# Altium project 2AM.PrjPcb
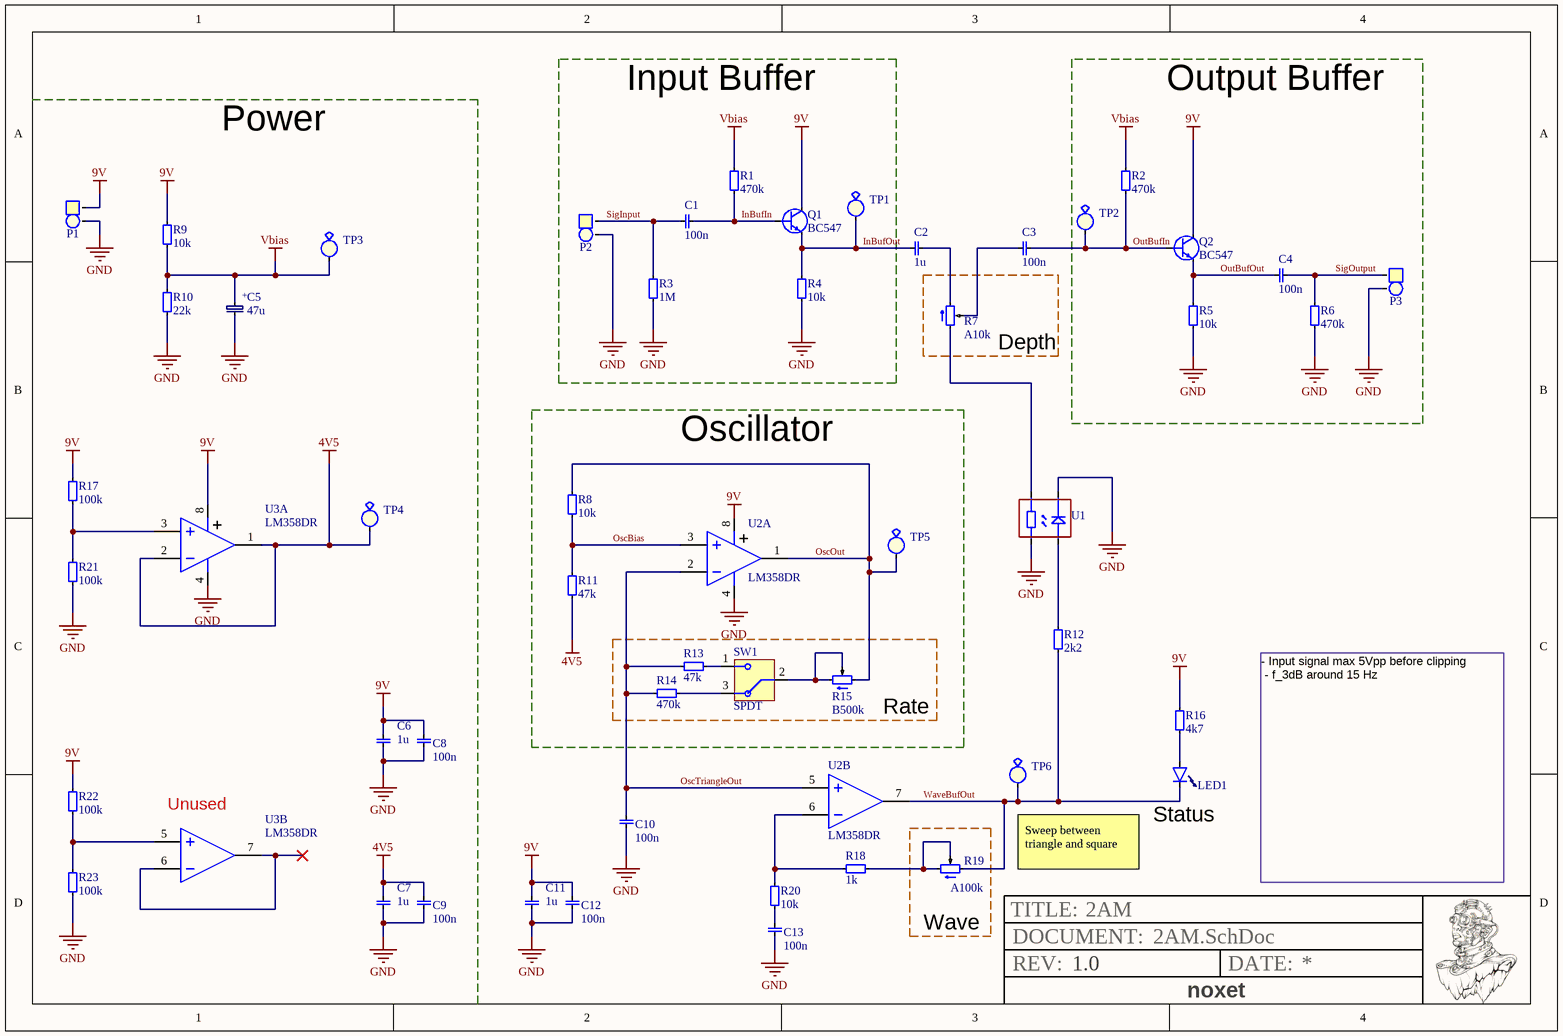
[diagram p0: 2AM.SchDoc]
Revision: 1.0; Title: 2AM
1 sheet, 52 parts. Net scope: global (net labels, ports and power ports of the same name join across sheets).
Board file: 2AM.PcbDoc

## Sheet 2AM.SchDoc: 2AM
size A4; SheetNumber: 1; SheetTotal: 1

### Parts
C1  value 100n  [0805, cap]  (hidden comment: TH, cap)
C2  value 1u  [0805, cap]  (hidden comment: TH, cap)
C3  value 100n  [0805, cap]  (hidden comment: TH, cap)
C4  value 100n  [0805, cap]  (hidden comment: TH, cap)
C5  value 47u  [Cap, SMD, Polar, 5.3x5.3mm]  (hidden comment: Capacitor, TH 2mm)
C6  value 1u  [0805, cap]  (hidden comment: TH, cap)
C7  value 1u  [0805, cap]  (hidden comment: TH, cap)
C8  value 100n  [0805, cap]  (hidden comment: TH, cap)
C9  value 100n  [0805, cap]  (hidden comment: TH, cap)
C10  value 100n  [0805, cap]  (hidden comment: TH, cap)
C11  value 1u  [0805, cap]  (hidden comment: TH, cap)
C12  value 100n  [0805, cap]  (hidden comment: TH, cap)
C13  value 100n  [0805, cap]  (hidden comment: TH, cap)
LED1  0805, LED  [LED_Radial_5mm_Standoff_10mm]  (value not drawn)
P1  1x2 Pin Header  [padtwo_L]  (value not drawn)
P2  1x2 Pin Header  [padtwo_L]  (value not drawn)
P3  1x2 Pin Header  [padtwo_L]  (value not drawn)
Q1  BC547  [BC547_TO-92_BENT]
Q2  BC547  [BC547_TO-92_BENT]
R1  value 470k  [0805]  (hidden comment: TH, resistor)
R2  value 470k  [0805]  (hidden comment: TH, resistor)
R3  value 1M  [0805]  (hidden comment: TH, resistor)
R4  value 10k  [0805]  (hidden comment: TH, resistor)
R5  value 10k  [0805]  (hidden comment: TH, resistor)
R6  value 470k  [0805]  (hidden comment: TH, resistor)
R7  value A10k  [RK09_15mm]  (hidden comment: Potentiometer)
R8  value 10k  [0805]  (hidden comment: TH, resistor)
R9  value 10k  [0805]  (hidden comment: TH, resistor)
R10  value 22k  [0805]  (hidden comment: TH, resistor)
R11  value 47k  [0805]  (hidden comment: TH, resistor)
R12  value 2k2  [0805]  (hidden comment: TH, resistor)
R13  value 47k  [0805]  (hidden comment: TH, resistor)
R14  value 470k  [0805]  (hidden comment: TH, resistor)
R15  value B500k  [RK09_15mm]  (hidden comment: Potentiometer)
R16  value 4k7  [0805]  (hidden comment: TH, resistor)
R17  value 100k  [0805]  (hidden comment: TH, resistor)
R18  value 1k  [0805]  (hidden comment: TH, resistor)
R19  value A100k  [RK09_15mm]  (hidden comment: Potentiometer)
R20  value 10k  [0805]  (hidden comment: TH, resistor)
R21  value 100k  [0805]  (hidden comment: TH, resistor)
R22  value 100k  [0805]  (hidden comment: TH, resistor)
R23  value 100k  [0805]  (hidden comment: TH, resistor)
SW1  SPDT  [SW_SPDT_SMTS-102-A2]
TP1  In buf out  [testPoint]  (value not drawn)
TP2  Out Buf In  [testPoint]  (value not drawn)
TP3  Vbias  [testPoint]  (value not drawn)
TP4  4V5  [testPoint]  (value not drawn)
TP5  Osc Out  [testPoint]  (value not drawn)
TP6  Wave Buf Out  [testPoint]  (value not drawn)
U1  Optocoupler  [Optocoupler LED+LDR]  (value not drawn)
U2  LM358DR  [SOIC8]  (parts A,B of 2)
U3  LM358DR  [SOIC8]  (parts A,B of 2)

### Blocks framed on the sheet
Input Buffer: C1 P2 Q1 R1 R3 R4 TP1
Output Buffer: C4 P3 Q2 R2 R5 R6 TP2
Depth: R7
Oscillator: R8 R11 TP5 U2
Rate: R13-R15 SW1
Wave: R19

### Nets
4V5: C7.2 C9.2 R11.1 TP4.0 U3.1(OUT) U3.2(IN-)
9V: C6.2 C8.2 C11.2 C12.2 P1.1 Q1.1(C) Q2.1(C) R9.2 R16.1 R17.2 R22.2 U2.8(V+) U3.8(V+)
GND: C5.1 C6.1 C7.1 C8.1 C9.1 C10.1 C11.1 C12.1 C13.1 P1.2 P2.2 P3.2 R3.1 R4.1 R5.1 R6.1 R10.1 R21.1 R23.1 U1.3 U1.K U2.4(V-) U3.4(V-)
Vbias: C5.2 R1.2 R2.2 R9.1 R10.2 TP3.0
InBufIn: C1.2 Q1.2(B) R1.1
InBufOut: C2.2 Q1.3(E) R4.2 TP1.0
OscBias: R8.2 R11.2 U2.3(IN+)
OscOut: R8.1 R15.1 TP5.0 U2.1(OUT)
OscTriangleOut: C10.2 R13.1 R14.1 U2.2(IN-) U2.5(IN+)
OutBufIn: C3.2 Q2.2(B) R2.1 TP2.0
OutBufOut: C4.1 Q2.3(E) R5.2
SigInput: C1.1 P2.1 R3.2
SigOutput: C4.2 P3.1 R6.2
WaveBufOut: LED1.0(Cathode) R12.2 R19.1 TP6.0 U2.7(OUT)
NetC2_1: C2.1 R7.3
NetC3_1: C3.1 R7.2
NetC13_2: C13.2 R20.1
NetLED1_1: LED1.1 R16.2
NetR7_1: R7.1 U1.4
NetR12_1: R12.1 U1.A
NetR13_2: R13.2 SW1.1
NetR14_2: R14.2 SW1.3
NetR15_2: R15.2 R15.3 SW1.2
NetR17_1: R17.1 R21.2 U3.3(IN+)
NetR18_1: R18.1 R20.2 U2.6(IN-)
NetR18_2: R18.2 R19.2 R19.3
NetR22_1: R22.1 R23.2 U3.5(IN+)
NetU3_6: U3.6(IN-) U3.7(OUT)

### Notes on the sheet
- Power
- (near U3) Unused
- (near LED1) Status
- (near TP6) Sweep between triangle and square
- - Input signal max 5Vpp before clipping
  - f_3dB around 15 Hz
- TITLE:
- REV:
- DOCUMENT:
- noxet
- DATE:
- (in symbol Capacitor, TH 2mm) +

### Library data of the parts
C5 = Capacitor, TH 2mm: Capacitor TH 3.5mm; Supplier: *; Order number: *; Supplier 1: Mouser; Supplier Part Number 1: 710-865080342006
LED1 = 0805, LED: Value: 0805 LED
P1-P3 = 1x2 Pin Header: 2.54 mm, TH; Value: 1x2 Pin Header
Q1 Q2 = NPN CBE
SW1 = Switch SPDT: Toggle switch SPDT
TP1-TP6 = Test Point: Value: Test point; Farnell: 1702006
U1 = Optocoupler LED+LDR
U2 U3 = LM358DR: IC OPAMP GP 700KHZ 8SOIC; Manufacturer: Texas Instruments; Number of Circuits: 2; Nominal Supply Current: 1.2mA; Max Supply Voltage: 32V; Min Supply Voltage: 3V; Operating Supply Voltage: 16V; Slew Rate: 0.3V/µs; Common Mode Rejection Ratio: 65dB; Min Dual Supply Voltage: 1.5V; Output Current: 30mA; Voltage Gain: 100dB; Input Bias Current: 250nA; Input Offset Voltage (Vos): 7mV; Operating Supply Current: 1mA; Amplifier Type: GENERAL PURPOSE; Dual Supply Voltage: 9V; Supplier 1: Mouser; Manufacturer Part Number: LM358DR; RoHS: Yes; Category: Amplifiers - Op Amps, Buffer, Instrumentation; Stock 1: 281120; Pricing 1: 1=0,37000, 10=0,29900, 50=0,29900, 100=0,18500, 1000=0,11500, 10000=0,10400 (USD); Mounting Technology: Surface Mount; Case/Package: SOIC; Pins: 8; Contact Plating: Gold; Min Operating Temperature: 0°C; Max Operating Temperature: 70°C; Packaging: Tape and Reel; Number of Channels: 2; Bandwidth: 700kHz; Gain Bandwidth Product: 700kHz; Package Quantity: 2500; Supply Current: 1.2mA; Max Dual Supply Voltage: 16V; Output Current per Channel: 30mA; Series: -; Technology: BIPOLAR; Number of Elements: 2; Number of Amplifiers: 2; Unity Gain Bandwidth Product: 700kHz; Power Supply Rejection Ratio (PSRR): 65dB; Length: 4.9mm; Width: 3.91mm; Height: 1.58mm; Radiation Hardening: No; Lead Free: Lead Free; RoHS Compliant: Yes; Reach SVHC Compliant: Yes; ComponentLink1URL: https://datasheet.ciiva.com/1795/lm358-1795488.pdf?src-supplier=Digi-Key; ComponentLink1Description: https://datasheet.ciiva.com/1795/lm358-1795488.pdf?src-supplier=Digi-Key; ComponentLink2URL: https://datasheet.ciiva.com/27056/2016330-27056228.pdf?src-supplier=Jameco; ComponentLink2Description: https://datasheet.ciiva.com/27056/2016330-27056228.pdf?src-supplier=Jameco; ComponentLink3URL: https://datasheet.ciiva.com/7709/1874566-7709823.pdf?src-supplier=Element14; ComponentLink3Description: https://datasheet.ciiva.com/7709/1874566-7709823.pdf?src-supplier=Element14; ComponentLink4URL: https://datasheet.ciiva.com/46385/1874566-46385851.pdf?src-supplier=Element14; ComponentLink4Description: https://datasheet.ciiva.com/46385/1874566-46385851.pdf?src-supplier=Element14; ComponentLink5URL: https://datasheet.ciiva.com/46390/1874566-46390414.pdf?src-supplier=Element14; ComponentLink5Description: https://datasheet.ciiva.com/46390/1874566-46390414.pdf?src-supplier=Element14; ComponentLink6URL: https://datasheet.ciiva.com/1795/lm358-1795487.pdf?src-supplier=Digi-Key; ComponentLink6Description: https://datasheet.ciiva.com/1795/lm358-1795487.pdf?src-supplier=Digi-Key; ComponentLink7URL: https://datasheet.ciiva.com/1795/lm358-1795489.pdf?src-supplier=Digi-Key; ComponentLink7Description: https://datasheet.ciiva.com/1795/lm358-1795489.pdf?src-supplier=Digi-Key; ComponentLink8URL: https://datasheet.ciiva.com/2973/lm358a-2973386.pdf?src-supplier=Avnet; ComponentLink8Description: https://datasheet.ciiva.com/2973/lm358a-2973386.pdf?src-supplier=Avnet; Supplier Part Number 1: 595-LM358DR
C1-C4 C6-C13 = TH, cap: Supplier: Farnell; Order number: *
R7 R15 R19 = Potentiometer: ELFA: 300-08-353